# EAGLE design output board 7eurorack (EAGLE 8.2.2)
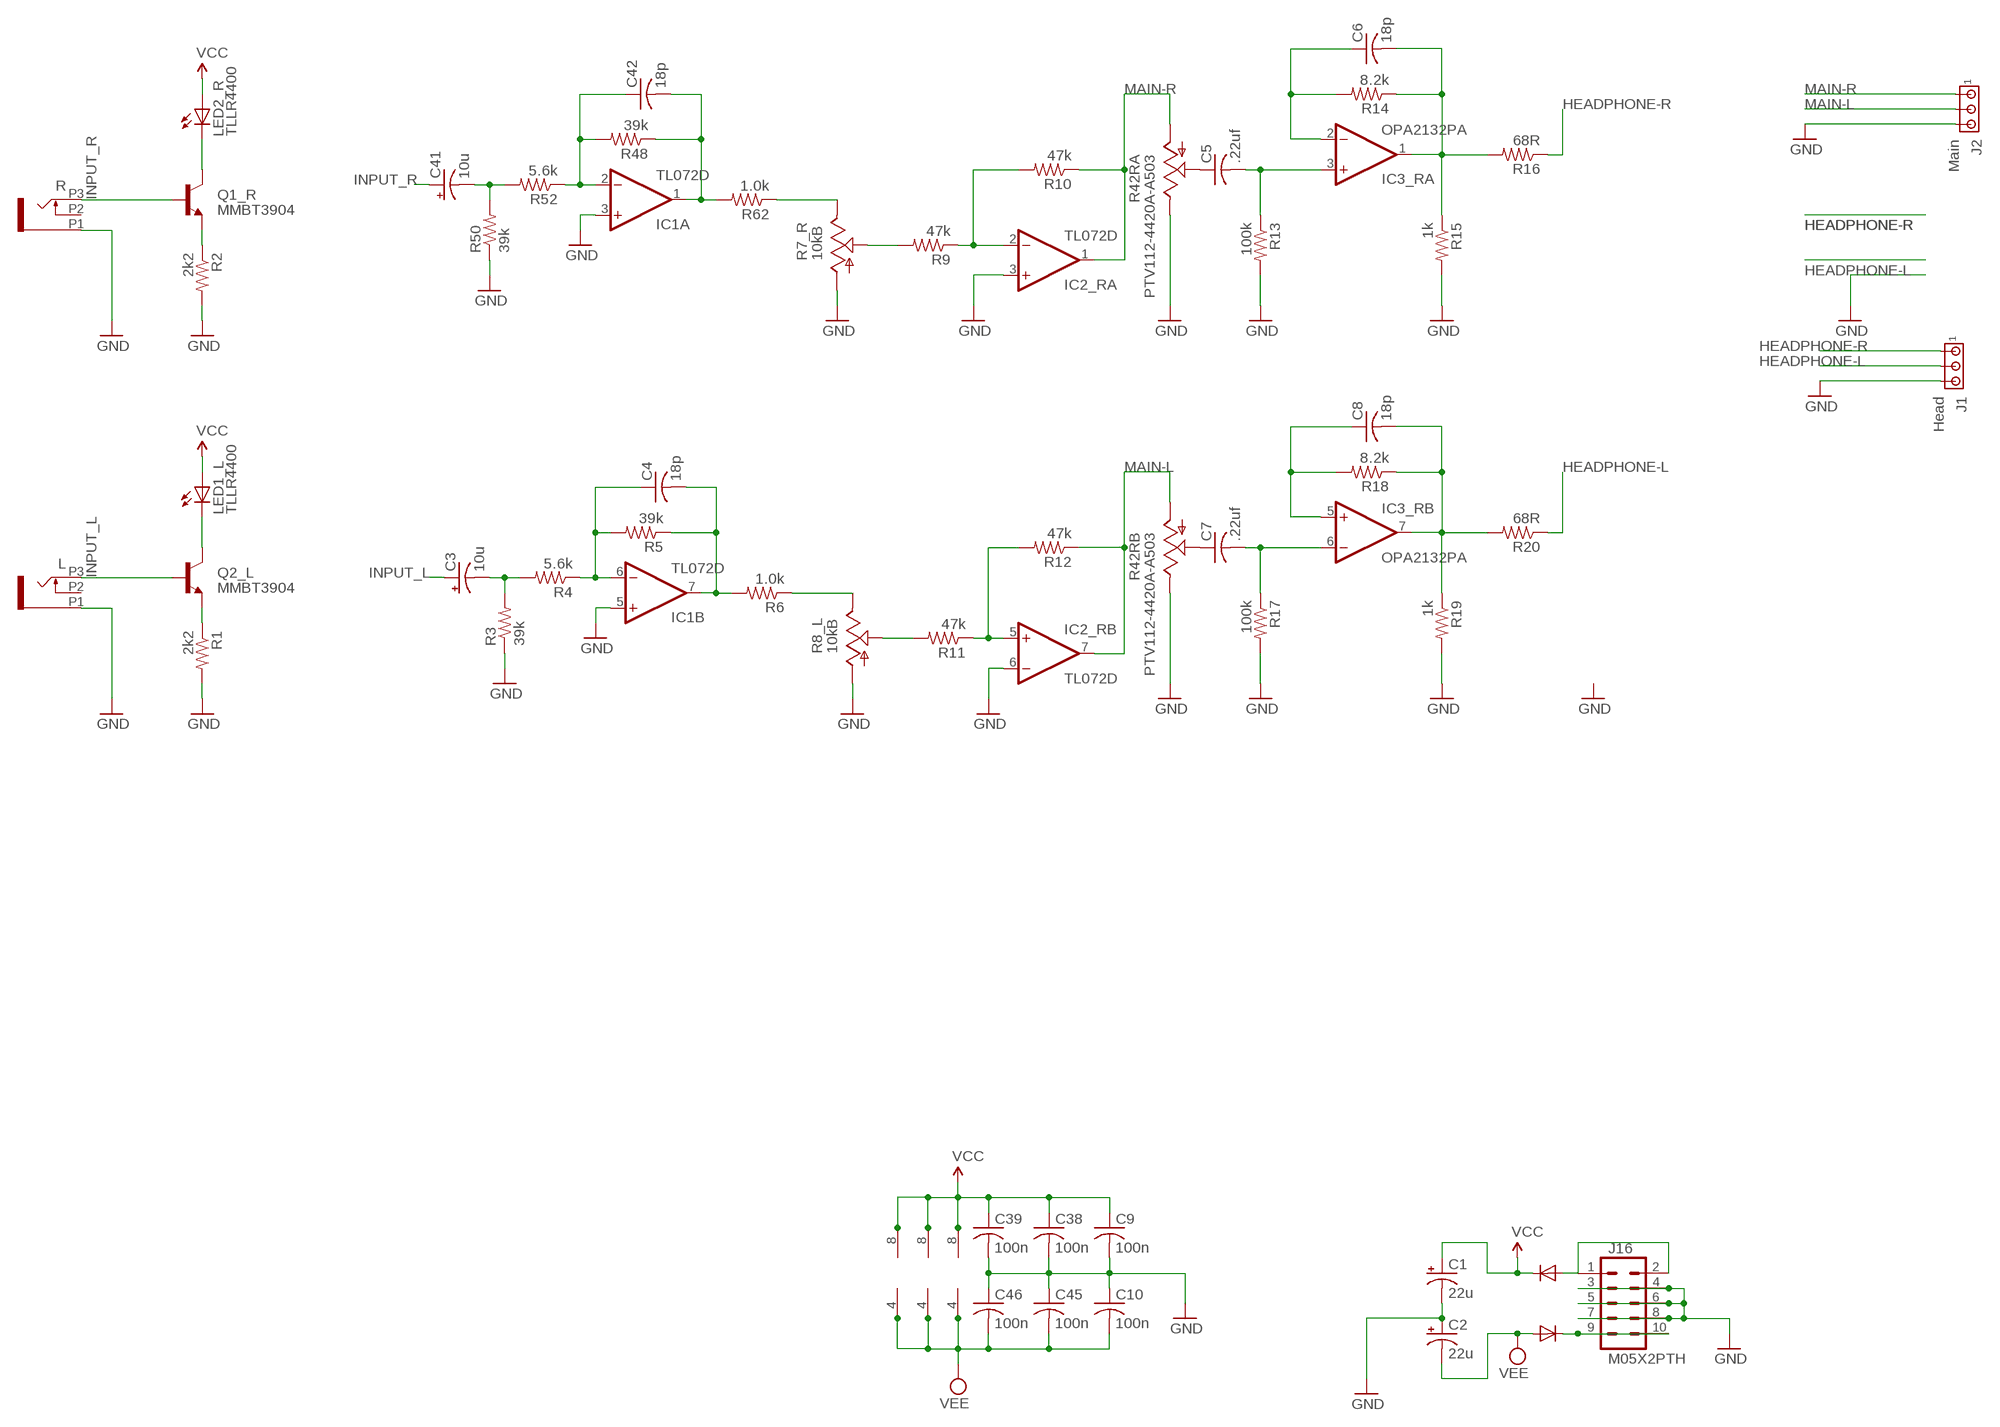
[diagram p0: schematic, sheet 1]

## Parts
C1  22u  CPOL-USB  [PANASONIC_B]
C2  22u  CPOL-USB  [PANASONIC_B]
C3  10u  CPOL-USB  [PANASONIC_B]
C4  18p  C-USC0603  [C0603]
C5  .22uf  C-USC0603  [C0603]
C6  18p  C-USC0603  [C0603]
C7  .22uf  C-USC0603  [C0603]
C8  18p  C-USC0603  [C0603]
C9  100n  C-USC0603  [C0603]
C10  100n  C-USC0603  [C0603]
C38  100n  C-USC0603  [C0603]
C39  100n  C-USC0603  [C0603]
C41  10u  CPOL-USB  [PANASONIC_B]
C42  18p  C-USC0603  [C0603]
C45  100n  C-USC0603  [C0603]
C46  100n  C-USC0603  [C0603]
D1  1N5819HW  DIODE-SOD123  [SOD123]
D2  1N5819HW  DIODE-SOD123  [SOD123]
IC1  TL072D  [SO08]
IC2_R  TL072D  [SO08]
IC3_R  OPA2132PA  TL072D  [SO08]
J1  Head  MTA03-100  [10X03MTA]
J2  Main  MTA03-100  [10X03MTA]
J16  M05X2PTH  [AVR_ICSP]
L  PJ301_THONKICONN6  [WQP_PJ_301M6]
LED1_L  TLLR4400  [LED3MM]
LED2_R  TLLR4400  [LED3MM]
Q1_R  MMBT3904  MMBT3904LT1-NPN-SOT23-BEC  [SOT23-BEC]
Q2_L  MMBT3904  MMBT3904LT1-NPN-SOT23-BEC  [SOT23-BEC]
R  PJ301_THONKICONN6  [WQP_PJ_301M6]
R1  2k2  R-US_R0603  [R0603]
R2  2k2  R-US_R0603  [R0603]
R3  39k  R-US_R0603  [R0603]
R4  5.6k  R-US_R0603  [R0603]
R5  39k  R-US_R0603  [R0603]
R6  1.0k  R-US_R0603  [R0603]
R7_R  10kB  POT_USVERTICAL_PS  [ALPS_POT_VERTICAL_PS]
R8_L  10kB  POT_USVERTICAL_PS  [ALPS_POT_VERTICAL_PS]
R9  47k  R-US_R0603  [R0603]
R10  47k  R-US_R0603  [R0603]
R11  47k  R-US_R0603  [R0603]
R12  47k  R-US_R0603  [R0603]
R13  100k  R-US_R0603  [R0603]
R14  8.2k  R-US_R0603  [R0603]
R15  1k  R-US_R0603  [R0603]
R16  68R  R-US_R0603  [R0603]
R17  100k  R-US_R0603  [R0603]
R18  8.2k  R-US_R0603  [R0603]
R19  1k  R-US_R0603  [R0603]
R20  68R  R-US_R0603  [R0603]
R42  PTV112-4420A-A503  POT_US_DUAL_GANG  [BOURNS_PTV112]
R48  39k  R-US_R0603  [R0603]
R50  39k  R-US_R0603  [R0603]
R52  5.6k  R-US_R0603  [R0603]
R62  1.0k  R-US_R0603  [R0603]

## Nets
GND: C1.- C2.+ C9.2 C10.1 C38.2 C39.2 C45.1 C46.1 IC1.3(A:+IN) IC1.5(B:+IN) IC2_R.3(A:+IN) IC2_R.6(B:-IN) J1.3 J2.3 J16.3 J16.4 J16.5 J16.6 J16.7 J16.8 L.P1 R1.2 R2.2 R3.1 R7_R.P$3(A) R8_L.P$3(A) R13.2 R15.2 R17.2 R19.2 R42.3(RB:E) R42.3P(RA:E) R50.1 R.P1
HEADPHONE-L: J1.2 R20.1
HEADPHONE-R: J1.1 R16.1
INPUT_L: C3.+ L.P3 Q2_L.B
INPUT_R: C41.+ Q1_R.B R.P3
MAIN-L: IC2_R.7(B:OUT) J2.2 R12.1 R42.1(RB:A)
MAIN-R: IC2_R.1(A:OUT) J2.1 R10.1 R42.1P(RA:A)
N$1: D2.C J16.9 J16.10
N$2: Q2_L.E R1.1
N$3: Q1_R.E R2.1
N$4: C3.- R3.2 R4.2
N$5: C4.1 IC1.6(B:-IN) R4.1 R5.2
N$6: D1.A J16.1 J16.2
N$7: LED1_L.K(C) Q2_L.C
N$8: LED2_R.K(C) Q1_R.C
N$9: C4.2 IC1.7(B:OUT) R5.1 R6.2
N$10: R8_L.P$2(S) R11.2
N$11: R7_R.P$2(S) R9.2
N$13: IC2_R.2(A:-IN) R9.1 R10.2
N$14: IC2_R.5(B:+IN) R11.1 R12.2
N$16: C7.1 R42.2(RB:S)
N$17: C5.2 IC3_R.3(A:+IN) R13.1
N$18: C6.2 IC3_R.1(A:OUT) R14.1 R15.1 R16.2
N$19: C6.1 IC3_R.2(A:-IN) R14.2
N$21: C7.2 IC3_R.6(B:-IN) R17.1
N$22: C8.2 IC3_R.7(B:OUT) R18.1 R19.1 R20.2
N$23: C41.- R50.2 R52.2
N$24: C8.1 IC3_R.5(B:+IN) R18.2
N$25: C42.1 IC1.2(A:-IN) R48.2 R52.1
N$26: C5.1 R42.2P(RA:S)
N$28: C42.2 IC1.1(A:OUT) R48.1 R62.2
ROUT_JACK: R7_R.P$1(E) R62.1
ROUT_JACK1: R6.1 R8_L.P$1(E)
VCC: C1.+ C9.1 C38.1 C39.1 D1.C IC1.8(P:V+) IC2_R.8(P:V+) IC3_R.8(P:V+) LED1_L.A LED2_R.A
VEE: C2.- C10.2 C45.2 C46.2 D2.A IC1.4(P:V-) IC2_R.4(P:V-) IC3_R.4(P:V-)
Unconnected: L.P2 R.P2

## Library data of the parts
C1-C3 C41 = rcl:CPOL-US: POLARIZED CAPACITOR, American symbol
C4-C10 C38 C39 C42 C45 C46 = rcl:C-US: CAPACITOR, American symbol
D1 D2 = diode:DIODE-: DIODE
IC1 IC2_R IC3_R = og-linear:TL072: OP AMP
J1 J2 = con-amp:MTA03-100: AMP connector
J16 = og-header:M05X2: Header 5x2 Standard 10-pin dual row 0.1" header. Commonly used with AVR-ISP. Use with Spark Fun Electronics SKU: PRT-00778
L R = og-pj301:PJ301_THONKICONN
LED1_L LED2_R = led:TLLR4400: Low Current (2mA) LED 3 mm Tinted Diffused Package color RED Source: Data sheet <http://www.farnell.com/datasheets/391100.pdf>; MF: VISHAY SEMICONDUCTOR; OC_FARNELL: 1612437
Q1_R Q2_L = transistor:*-NPN-: NPN Transistror BF959 corrected 2008.03.06
R1-R6 R9-R20 R48 R50 R52 R62 = rcl:R-US_: RESISTOR, American symbol
R7_R R8_L = pot-alps:POT_US
R42 = og-pots:POT_US_DUAL_GANG

## Board
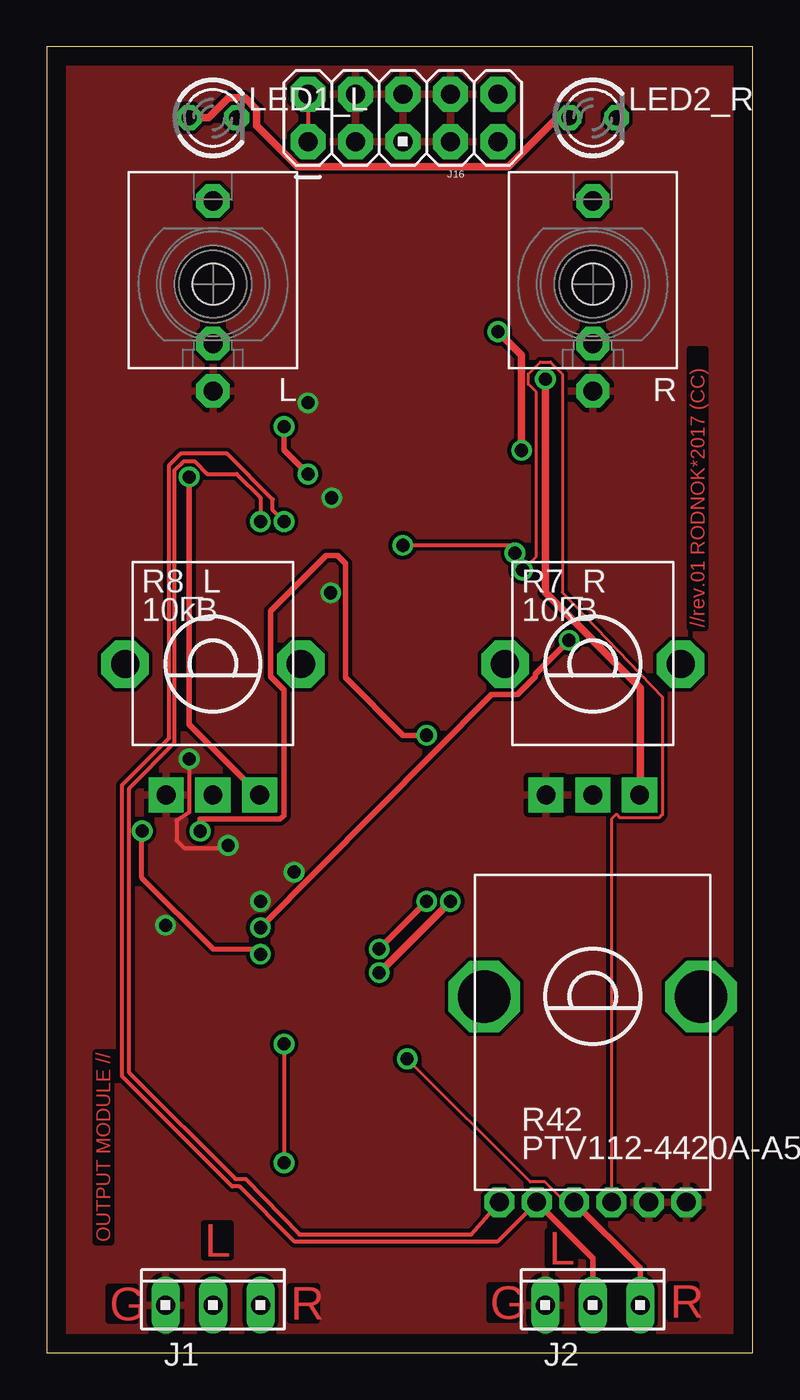
[diagram p1: board, top side]
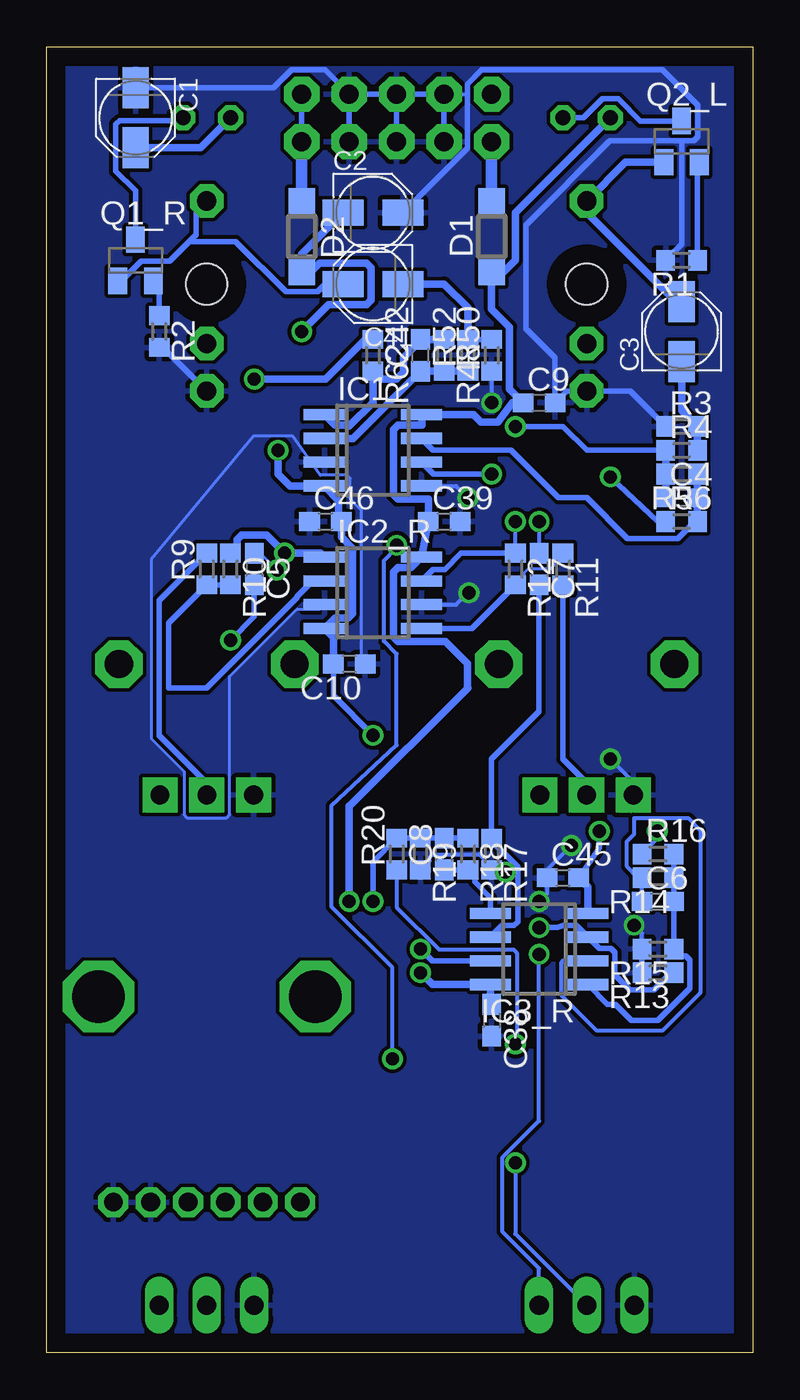
[diagram p2: board, bottom side, seen from below]

Size 37.77 x 69.84 mm. Coordinates in mm from the lower left corner, seen from the top.
Outline: 0,0 37.77,0 37.77,69.84 0,69.84 0,0
Copper layers (1*16): Top 0.035mm / dielectric 1.5mm / Bottom 0.035mm
Design rules "default": minimum track width 10mil, minimum drill 24mil, track to track 8mil, track to pad 8mil, pad to pad 8mil, via to via 8mil, smd to smd 8mil, copper to edge 40mil, drill to drill 8mil, minimum pad ring 10mil, minimum via ring 8mil, stop-mask expansion 4mil, vias tented up to drill 0mil, thermal gap 10mil

### Footprints (pad centres in the part's own frame; a part is rotated, then mirrored left to right if it is on the bottom)
PANASONIC_B = smd 2.2 x 1.4: + 1.6,0; - -1.6,0
C0603 = smd 1.1 x 1: 1 -0.85,0; 2 0.85,0
SOD123 = smd 1.4 x 1.4: A 1.9,0; C -1.9,0
SO08 = smd 0.6 x 2.2: 1 -1.905,-2.6; 2 -0.635,-2.6; 3 0.635,-2.6; 4 1.905,-2.6; 5 1.905,2.6; 6 0.635,2.6; 7 -0.635,2.6; 8 -1.905,2.6
10X03MTA = drill 1.016 long: 1 2.54,0; 2 0,0; 3 -2.54,0
AVR_ICSP = drill 1.016 pad 1.88 octagon: 1 -1.27,5.08; 2 1.27,5.08; 3 -1.27,2.54; 4 1.27,2.54; 5 -1.27,0; 6 1.27,0; 7 -1.27,-2.54; 8 1.27,-2.54; 9 -1.27,-5.08; 10 1.27,-5.08
WQP_PJ_301M6 = drill 1.016 pad 1.778 octagon: P1 0,-5.715; P2 0,-3.175; P3 0,4.445 | hole 2.2: 0,0
LED3MM = drill 0.813 octagon: A -1.27,0; K 1.27,0
SOT23-BEC = smd 1 x 1.4: B -0.95,-1.1; C 0,1.1; E 0.95,-1.1
R0603 = smd 1 x 1.1: 1 -0.85,0; 2 0.85,0
ALPS_POT_VERTICAL_PS = drill 1 pad 1.88 square: P$1 -2.5,7; P$2 0,7; P$3 2.5,7 | drill 1.5 pad 2.54 octagon: P$4 -4.7,0; P$5 4.7,0
BOURNS_PTV112 = drill 1 pad 1.6 octagon: 1 -3,-11; 1P -1,-11; 2 -5,-11; 2P 1,-11; 3 5,-11; 3P 3,-11 | drill 2.8 pad 3.81 octagon: P$1 5.8,0; P$5 -5.8,0

### Placement (x,y rotation side)
C1  33.02,66.04 270 bottom
C2  20.32,60.96 0 bottom
C3  3.81,54.61 90 bottom
C4  3.81,45.72 0 bottom
C5  26.67,41.91 270 bottom
C6  5.08,24.13 0 bottom
C7  11.43,41.91 270 bottom
C8  16.51,26.67 90 bottom
C9  11.43,50.8 0 bottom
C10  21.59,36.83 180 bottom
C38  13.97,17.78 270 bottom
C39  16.51,44.45 0 bottom
C41  20.32,57.15 180 bottom
C42  17.78,53.34 90 bottom
C45  10.16,25.4 0 bottom
C46  22.86,44.45 0 bottom
D1  13.97,59.69 90 bottom
D2  24.13,59.69 270 bottom
IC1  20.32,48.26 270 bottom
IC2_R  20.32,40.64 270 bottom
IC3_R  11.43,21.59 90 bottom
J1  8.89,2.54 0 top
J2  29.21,2.54 0 top
J16  19.05,66.04 90 top
L  8.89,57.15 0 top
LED1_L  8.89,66.04 0 top
LED2_R  29.21,66.04 0 top
Q1_R  33.02,58.42 0 bottom
Q2_L  3.81,64.77 0 bottom
R  29.21,57.15 0 top
R1  3.81,58.42 180 bottom
R2  31.75,54.61 270 bottom
R3  3.81,49.53 0 bottom
R4  3.81,48.26 0 bottom
R5  3.81,46.99 180 bottom
R6  3.81,44.45 0 bottom
R7_R  29.21,36.83 180 top
R8_L  8.89,36.83 180 top
R9  29.21,41.91 90 bottom
R10  27.94,41.91 270 bottom
R11  10.16,41.91 270 bottom
R12  12.7,41.91 270 bottom
R13  5.08,20.32 180 bottom
R14  5.08,25.4 180 bottom
R15  5.08,21.59 180 bottom
R16  5.08,26.67 0 bottom
R17  13.97,26.67 270 bottom
R18  15.24,26.67 270 bottom
R19  17.78,26.67 270 bottom
R20  19.05,26.67 90 bottom
R42  29.21,19.05 0 top
R48  16.51,53.34 270 bottom
R50  13.97,53.34 90 bottom
R52  15.24,53.34 90 bottom
R62  20.32,53.34 270 bottom

### Tracks (layer width: path | path; a pad name or v marks a point on that pad's centre or on a via)
GND  (via drill 0.7)
  Top 0.203: v15.19,40.64 15.24,40.64 | v9.7,27.13 9.83,27 7.34,27 6.94,27.4 6.94,28.48 7.62,28.91 v7.62,31.75 | v13.23,25.7 13.2,25.7 13.19,25.71
  Bottom 0.152: C10.1 20.93,37.02 20.93,45.05 21.68,45.8 21.54,45.94 21.54,46.77 21.7,46.93 23.14,46.93 24.62,49.02 26.71,49.02 32.18,42.41 32.18,32.84 30.43,31.09 30.43,28.77 30.27,28.61 28.15,28.61 27.99,28.77 27.99,36.17 24.38,39.78 23.14,39.78 IC2_R.3 | 14.41,26.26 R17.2 | J16.4 15.26,67.31
  Bottom 0.203: R19.2 17.29,26.31 17.29,26.49 17.13,26.65 14.62,26.65 14.41,26.44 14.41,26.26 | IC1.5 15.88,46.36 v15.24,45.72 | R50.1 v13.97,50.8 | IC2_R.6 15.88,40 15.24,40.64 v15.19,40.64 | R8_L.P$3 6.39,30.52 v7.62,31.75 | v9.7,27.13 11.01,25.82 C45.1 11.01,24.55 v11.43,24.13 | R15.2 5.93,22.44 v6.35,22.86 | R17.2 13.35,25.82 v13.23,25.7
  Bottom 0.305: R13.2 R15.2 | R.P1 31.54,53.76 R2.2 | J16.3 J16.4 J16.6 | J16.5 J16.6 | J16.7 J16.8 | J16.6 J16.8 | C1.- 25.63,67.64 24.67,68.61 22.88,68.61 J16.8 | 3.81,64.81 3.16,64.81 2.95,65.02 2.95,66.72 4.84,68.61 14.51,68.61 15.26,67.85 15.26,67.31 15.26,64.42 C2.+ | 3.81,64.81 7.64,64.81 12.14,60.31 12.14,54.78 10.58,53.22 C9.2 9.95,51.44 L.P1 6.56,51.44 R3.1 | R1.2 3.81,59.27 3.81,64.81
  pour Bottom: 0,0 38.1,0 37.43,70.01 0,69.85
  pour Top: 0,69.85 0,0 38.1,0 37.47,69.97
HEADPHONE-L  (via drill 0.7)
  Top 0.203: v12.7,16.51 v12.7,10.16
  Bottom 0.203: R20.1 19.05,23.83 16.78,21.56 12.8,21.56 12.62,21.38 12.62,16.79 12.7,16.72 v12.7,16.51 | v12.7,10.16 12.7,6.35 J1.2
HEADPHONE-R  (via drill 0.7)
  Top 0.203: 5.08,27.94 5.08,27.93 v5.11,27.9
  Top 0.254: 5.08,27.93 5.08,25.4 8.89,21.59 11.43,21.59 v11.43,21.31
  Bottom 0.203: J1.1 11.43,4.5 13.38,6.46 13.38,10.44 11.43,12.4 v11.43,21.31 | v5.11,27.9 5.11,27.5 R16.1
INPUT_L
  Bottom 0.152: C3.+ 3.81,57.15 C3.+
  Bottom 0.203: 3.81,55.88 C3.+
  Bottom 0.406: 3.81,55.88 8.89,60.96 L.P3 6.81,63.67 Q2_L.B
INPUT_R
  Bottom 0.152: C41.+ 22.09,57.32 22.15,57.32
  Bottom 0.305: Q1_R.B 33.77,57.32 32.72,58.38 31.19,58.38 | 31.19,58.38 30.15,59.42 27.66,59.42 24.98,56.73 23.28,56.73 22.7,57.32 22.15,57.32 | R.P3 29.29,61.52 29.44,61.52 29.77,61.19 29.77,59.8 31.19,58.38
MAIN-L  (via drill 0.7)
  Top 0.203: v12.7,44.45 12.09,45.06 12.09,45.64 9.64,48.08 7.17,48.08 6.53,47.44 6.53,32.86 4.02,30.34 4.02,14.8 9.92,8.89 10.31,8.89 13.26,5.94 24.1,5.94 R42.1
  Top 0.305: J2.2 29.21,5.05 R42.1
  Bottom 0.203: R12.1 v12.7,44.45
  Bottom 0.305: IC2_R.7 17.11,41.89 16.47,41.89 15.6,42.76 R12.1
MAIN-R  (via drill 0.7)
  Top 0.152: v19.28,15.71 25.86,9.13 26.66,9.13 27.74,8.05 R42.1P
  Top 0.203: v19.05,43.18 25.04,43.18 v25.04,42.76
  Top 0.305: J2.1 31.75,4.51 R42.1P
  Bottom 0.203: v19.05,43.18 19.05,43.05 19.73,42.36 19.73,38.06 19.05,37.37 19.05,32.5 22.53,29.27 22.53,23.85 19.28,20.6 v19.28,15.71
  Bottom 0.406: IC2_R.1 23.13,42.76 v25.04,42.76 26,43.72 27.34,43.72 27.58,43.48 27.58,43.12 R10.1
N$1
  Bottom 0.305: J16.10 J16.9
  Bottom 0.61: J16.9 D2.C
N$2
  Bottom 0.305: R1.1 2.96,63.57 Q2_L.E
N$3
  Bottom 0.305: R2.1 31.75,57 Q1_R.E
N$4
  Bottom 0.406: C3.- 3.81,50.38 R3.2 R4.2
N$5  (via drill 0.7)
  Top 0.305: v12.7,49.53 12.7,48.26 v13.97,46.99
  Bottom 0.305: R4.1 8.89,48.26 10.16,49.53 v12.7,49.53 | v13.97,46.99 17.09,46.99 IC1.6
  Bottom 0.406: R4.1 R5.2 C4.1
N$6
  Top 0.203: J16.2 J16.1
  Bottom 0.305: 13.97,62.23 D1.A
  Bottom 0.61: 13.97,62.23 J16.1
N$7
  Bottom 0.305: Q2_L.C 6.01,65.87 7.2,67.06 8.04,67.06 9.06,66.04 LED1_L.K
N$8
  Bottom 0.305: Q1_R.C 33.02,62.14 34.08,63.19 34.08,65.69 33.87,65.9 30.62,65.9 LED2_R.K
N$9
  Bottom 0.305: R6.2 3.11,44.45 4.01,43.54 6.71,43.54 8.89,45.72 10.39,45.72 12.95,48.28 17.11,48.28 IC1.7
  Bottom 0.406: C4.2 R5.1 R6.2
N$10
  Bottom 0.305: R11.2 10.16,31.75 8.89,30.48 R8_L.P$2
N$11
  Bottom 0.305: R7_R.P$2 29.21,30.48 31.75,33.02 31.75,40.22 R9.2
N$13
  Bottom 0.305: R10.2 R9.1 31.24,39.03 31.24,35.56 29.21,35.56 24.38,40.39 24.38,40.45 23.55,41.28 IC2_R.2
N$14
  Bottom 0.152: R12.2 12.21,41.55 12.21,41.73 12,41.93 10.81,41.93 10.65,42.09 10.65,42.27 R11.1
  Bottom 0.305: IC2_R.5 15.03,38.73 R12.2
N$16  (via drill 0.7)
  Top 0.203: v11.43,44.45 11.43,45.72 10.16,46.99 8.59,46.99 7.9,47.67 7.34,47.67 6.84,47.2 6.84,32.64 4.42,30.17 4.42,14.97 10.09,9.3 10.64,9.3 13.51,6.33 14.93,6.33 16.46,6.32 17.32,6.32 22.71,6.32 R42.2
  Bottom 0.203: v11.43,44.45 C7.1
N$17  (via drill 0.7)
  Top 0.305: v11.43,22.73 23.77,35.2 25.18,35.2 26.14,36.16 26.14,36.3 v27.94,38.1
  Bottom 0.305: C5.2 26.67,39.37 v27.94,38.1 | v11.43,22.73 10.45,22.73 10.13,22.84 9.44,22.84 IC3_R.3 8.22,21.61 7.58,21.61 7.37,21.4 7.37,20.21 6.58,19.41 5.28,19.41 4.38,20.32 R13.1
N$18
  Bottom 0.305: R16.2 R14.1 C6.2 R15.1 3.87,21.23 3.58,21.23 3.37,21.02 3.37,19.49 5.08,17.78 6.49,17.78 7.34,18.64 7.78,18.64 IC3_R.1
N$19
  Bottom 0.203: C6.1 R14.2 6.14,25.4 6.73,25.99 6.73,27.35 6.35,27.73 6.35,28.58 3.46,28.58 2.82,27.94 2.82,19.25 4.85,17.22 8.34,17.22 10.23,19.11 10.23,20.88 10.16,20.95 IC3_R.2
N$21
  Bottom 0.305: C7.2 11.43,34.29 13.97,31.75 R17.1 13.97,27.37 12.57,25.98 12.57,23.05 12.78,22.84 13.42,22.84 IC3_R.6
N$22  (via drill 0.7)
  Top 0.305: v17.78,21.59 v20.32,24.13
  Bottom 0.305: R18.1 C8.2 R19.1 R20.2 20.32,26.25 v20.32,24.13 | IC3_R.7 17.14,20.95 v17.78,21.59
N$23
  Bottom 0.152: C41.- 17.78,57.15
  Bottom 0.305: R50.2 R52.2
  Bottom 0.406: R52.2 15.24,55.88 16.51,57.15 17.78,57.15
N$24
  Bottom 0.305: IC3_R.5 14.03,24.33 14.88,25.17 14.88,25.46 R18.2 C8.1
N$25
  Bottom 0.406: R52.1 R48.2 C42.1 21.38,48.89 IC1.2
N$26  (via drill 0.7)
  Top 0.152: R42.2P 30.21,28.56 30.46,28.81 30.65,28.61 32.77,28.61 32.93,28.77 32.93,35.06 27.58,40.67 27.58,52.34 26.94,52.98 26.4,52.98 25.76,52.34 25.76,51.8 26.19,51.37 26.19,42.58 v25.46,41.85
  Bottom 0.152: C5.1 26.37,42.76 v25.46,41.85
N$28
  Bottom 0.406: R48.1 C42.2 17.78,54.12 18.69,53.21 18.69,52.45 19.06,52.08 19.91,52.08 R62.2 20.32,50.81 21.59,49.54 21.65,49.6 22.36,49.6 IC1.1
ROUT_JACK  (via drill 0.7)
  Top 0.406: v26.67,52.07 26.67,40.64 31.75,35.56 31.75,29.87 R7_R.P$1
  Bottom 0.406: R62.1 20.74,54.19 22.86,52.07 v26.67,52.07
ROUT_JACK1  (via drill 0.7)
  Top 0.305: v7.62,46.84 7.62,33.6 R8_L.P$1
  Bottom 0.305: R6.1 5.08,44.45 v7.62,46.84
VCC  (via drill 0.7)
  Top 0.406: v21.59,24.13 v17.78,20.32 | LED2_R.A 27.3,66.04 24.69,63.42 13.41,63.42 11.23,65.61 11.23,66.48 10.6,67.11 9.72,67.11 8.65,66.04 LED1_L.A
  Bottom 0.152: 16.44,38.03 16.46,38.03
  Bottom 0.406: LED1_L.A 12.7,60.96 12.7,58.42 13.33,57.79 D1.C 13.97,55.81 13.01,54.86 13.01,51.53 C9.1 12.86,50.8 13.64,49.76 14.55,49.76 14.95,50.17 IC1.8 17.68,49.6 18.99,49.6 19.23,49.36 19.23,45.89 18.99,45.65 17.36,45.65 C39.1 IC2_R.8 18.28,41.98 18.99,41.98 19.23,41.74 19.23,38.27 18.99,38.03 16.46,38.03 | C1.+ 29.54,64.44 LED2_R.A | 21.59,29.21 21.59,29.24 | 21.59,29.21 v21.59,24.13 | v17.78,20.32 17.14,19.68 IC3_R.8 14.03,18.69 C38.1 | 16.44,38.03 15.27,36.86 15.27,35.59 15.24,35.56 21.59,29.21
VEE  (via drill 0.7)
  Top 0.305: v8.2,27.89 8.21,28.54 12.48,28.54 12.68,28.74 12.68,35.44 11.96,36.16 11.96,39.67 14.94,42.64 15.54,42.64 15.97,42.21 15.97,36.1 19.05,33.02 v20.32,33.02
  Top 0.406: v24.13,54.61 25.4,53.34 v25.4,48.26
  Bottom 0.305: C45.2 8.2,26.99 v8.2,27.89 | v20.32,33.02 22.44,35.14 C10.2
  Bottom 0.406: C2.- 24.13,58.75 D2.A 23.66,57.79 23.19,58.26 20.65,58.26 20.41,58.02 20.41,56.28 20.65,56.04 22.7,56.04 v24.13,54.61 | C45.2 8.83,24.92 IC3_R.4 | C10.2 22.44,38.25 IC2_R.4 22.36,39.3 21.65,39.3 21.41,39.54 21.41,43.01 22.01,43.61 C46.2 22.15,44.74 22.15,45.58 IC1.4 24.77,46.36 25.4,46.99 v25.4,48.26

### Text on the board
Top: //rev.01 RODNOK*2017 (CC) | OUTPUT MODULE // | L | L | G | R | G | R